# EAGLE design base-6u-at91sam7s-eval-r1 (EAGLE 4.16)
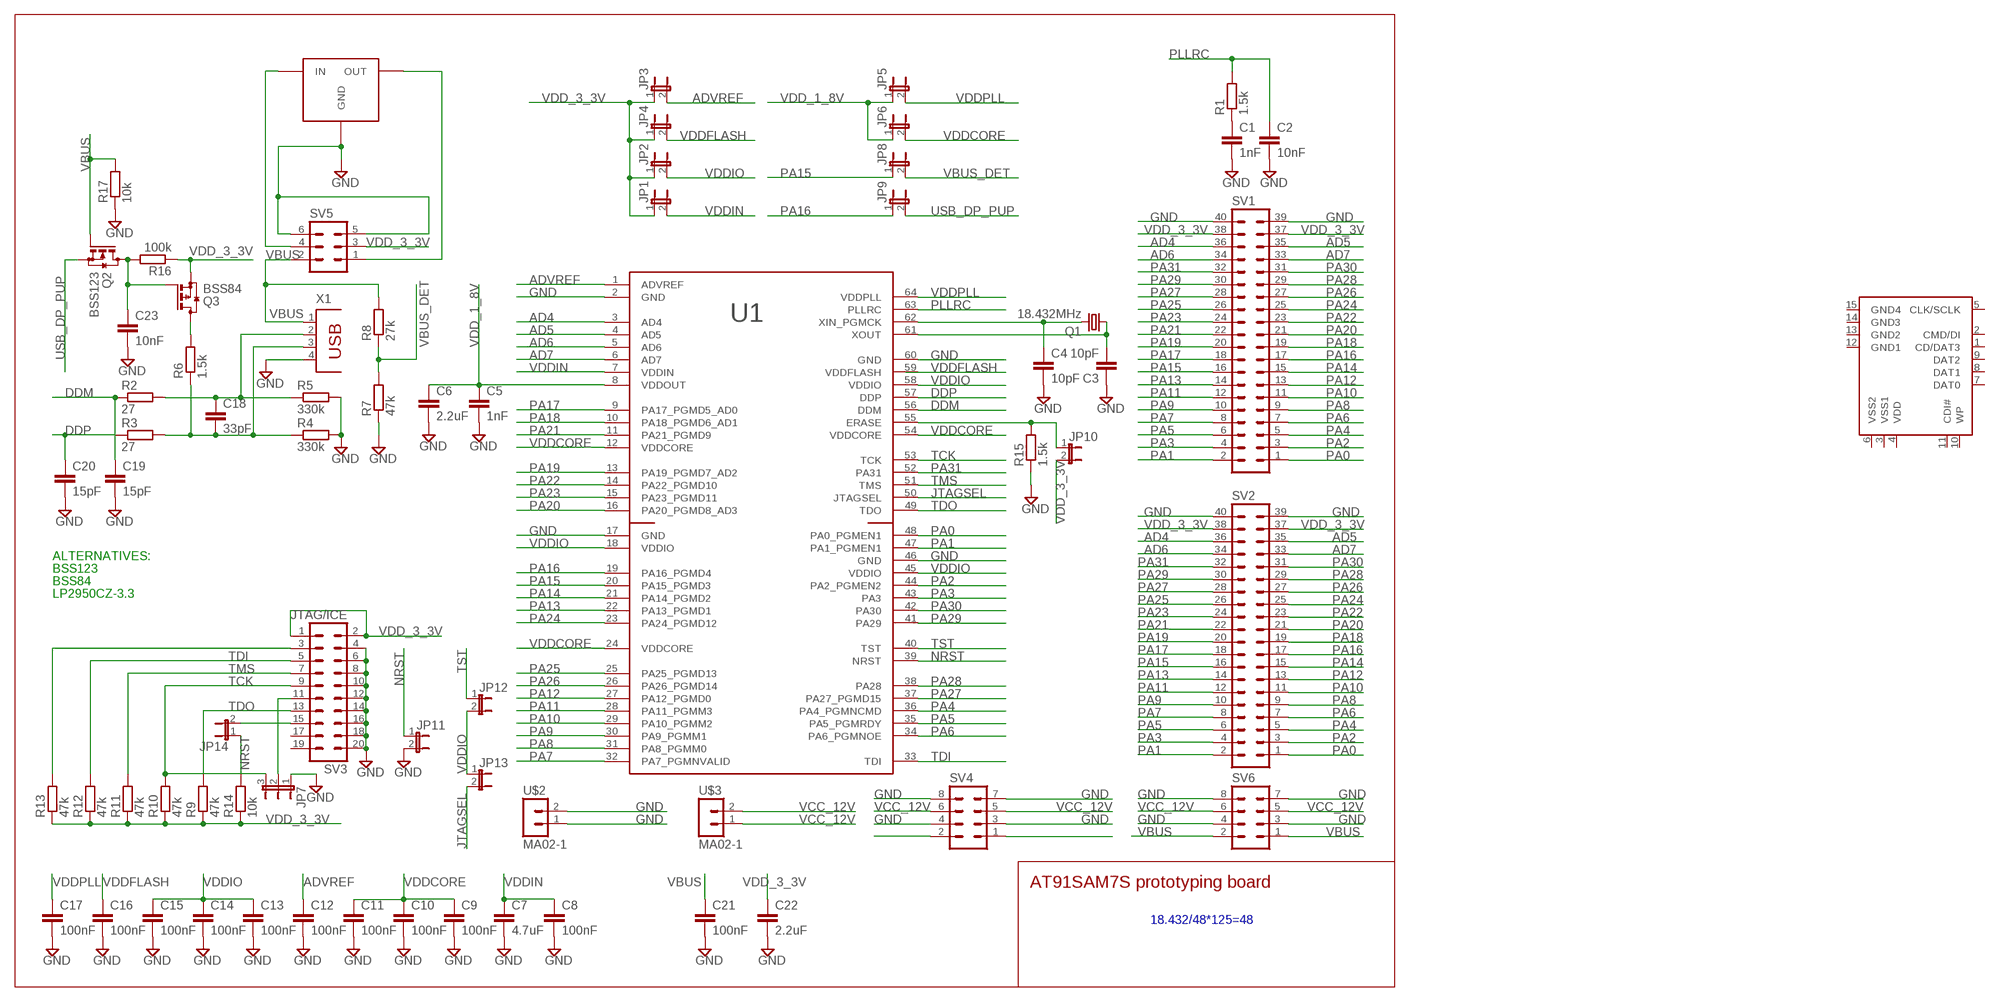
[diagram p0: schematic, sheet 1]

## Parts
C1  1nF  C-EUC0603  [C0603]
C2  10nF  C-EUC0603  [C0603]
C3  10pF  C-EUC0603  [C0603]
C4  10pF  C-EUC0603  [C0603]
C5  1nF  C-EUC0603  [C0603]
C6  2.2uF  C-EUC1206  [C1206]
C7  4.7uF  C-EUC1206  [C1206]
C8  100nF  C-EUC0603  [C0603]
C9  100nF  C-EUC0603  [C0603]
C10  100nF  C-EUC0603  [C0603]
C11  100nF  C-EUC0603  [C0603]
C12  100nF  C-EUC0603  [C0603]
C13  100nF  C-EUC0603  [C0603]
C14  100nF  C-EUC0603  [C0603]
C15  100nF  C-EUC0603  [C0603]
C16  100nF  C-EUC0603  [C0603]
C17  100nF  C-EUC0603  [C0603]
C18  33pF  C-EUC0603  [C0603]
C19  15pF  C-EUC0603  [C0603]
C20  15pF  C-EUC0603  [C0603]
C21  100nF  C-EUC0603  [C0603]
C22  2.2uF  C-EUC1206  [C1206]
C23  10nF  C-EUC0603  [C0603]
JP1  JP1E  [JP1]
JP2  JP1E  [JP1]
JP3  JP1E  [JP1]
JP4  JP1E  [JP1]
JP5  JP1E  [JP1]
JP6  JP1E  [JP1]
JP7  JP2E  [JP2]
JP8  JP1E  [JP1]
JP9  JP1E  [JP1]
JP10  JP1E  [JP1]
JP11  JP1E  [JP1]
JP12  JP1E  [JP1]
JP13  JP1E  [JP1]
JP14  JP1E  [JP1]
Q1  18.432MHz  CRYSTALHC49S  [HC49/S]
Q2  BSS123  [SOT23]
Q3  BSS84  [SOT23]
R1  1.5k  R-0603  [R0603]
R2  27  R-EU_R0603  [R0603]
R3  27  R-EU_R0603  [R0603]
R4  330k  R-EU_R0603  [R0603]
R5  330k  R-EU_R0603  [R0603]
R6  1.5k  R-EU_R0603  [R0603]
R7  47k  R-EU_R0603  [R0603]
R8  27k  R-EU_R0603  [R0603]
R9  47k  R-0603  [R0603]
R10  47k  R-0603  [R0603]
R11  47k  R-0603  [R0603]
R12  47k  R-0603  [R0603]
R13  47k  R-0603  [R0603]
R14  10k  R-0603  [R0603]
R15  1.5k  R-0603  [R0603]
R16  100k  R-EU_R0603  [R0603]
R17  10k  R-EU_R0603  [R0603]
SV1  MA20-2  [MA20-2]
SV2  MA20-2  [MA20-2]
SV3  JTAG/ICE  MA10-2W  [MA10-2W]
SV4  MA04-2  [MA04-2]
SV5  MA03-2  [MA03-2]
SV6  MA04-2  [MA04-2]
U1  AT91SAM7S64_LQFP64  [LQFP64]
U$1  LF33CDT  [TO-252]
U$2  MA02-1  [MA02-1]
U$3  MA02-1  [MA02-1]
U$4  SDCARDVAR2  [SDCMF-10915W010]
X1  PN61729  [PN61729]

## Nets
AD4: SV1.36 SV2.36 U1.3(AD4)
AD5: SV1.35 SV2.35 U1.4(AD5)
AD6: SV1.34 SV2.34 U1.5(AD6)
AD7: SV1.33 SV2.33 U1.6(AD7)
ADVREF: C12.1 JP3.2 U1.1(ADVREF)
DDM: C19.1 R2.1 U1.56(DDM)
DDP: C20.1 R3.1 U1.57(DDP)
GND: C1.2 C2.2 C3.1 C4.2 C5.2 C6.2 C7.2 C8.2 C9.2 C10.2 C11.2 C12.2 C13.2 C14.2 C15.2 C16.2 C17.2 C19.2 C20.2 C21.2 C22.2 C23.2 JP7.1 JP11.2 R4.2 R5.2 R7.1 R15.1 R17.1 SV1.39 SV1.40 SV2.39 SV2.40 SV3.4 SV3.6 SV3.8 SV3.10 SV3.12 SV3.14 SV3.16 SV3.18 SV3.20 SV4.3 SV4.4 SV4.7 SV4.8 SV5.5 SV5.6 SV6.3 SV6.4 SV6.7 SV6.8 U1.2(GND) U1.17(GND) U1.46(GND) U1.60(GND) U$1.3(GND) U$2.1 U$2.2 X1.4
JTAGSEL: JP13.2 U1.50(JTAGSEL)
N$1: C4.1 Q1.2 U1.62(XIN_PGMCK)
N$2: C3.2 Q1.1 U1.61(XOUT)
N$3: C1.1 R1.1
N$4: C18.1 R2.2 R5.1 X1.2
N$5: C18.2 R3.2 R4.1 R6.1 X1.3
N$7: Q3.3(D) R6.2
N$9: JP14.2 SV3.15
N$11: SV5.4 U$1.1(IN)
N$12: SV5.1 U$1.2(OUT)
N$13: R13.2 SV3.3
N$15: JP10.1 R15.2 U1.55(ERASE)
N$16: JP7.2 SV3.11
N$17: C23.1 Q2.3(D) Q3.1(G) R16.2
NRST: JP11.1 JP14.1 R14.2 U1.39(NRST)
PA0: SV1.1 SV2.1 U1.48(PA0_PGMEN1)
PA1: SV1.2 SV2.2 U1.47(PA1_PGMEN1)
PA2: SV1.3 SV2.3 U1.44(PA2_PGMEN2)
PA3: SV1.4 SV2.4 U1.43(PA3)
PA4: SV1.5 SV2.5 U1.36(PA4_PGMNCMD)
PA5: SV1.6 SV2.6 U1.35(PA5_PGMRDY)
PA6: SV1.7 SV2.7 U1.34(PA6_PGMNOE)
PA7: SV1.8 SV2.8 U1.32(PA7_PGMNVALID)
PA8: SV1.9 SV2.9 U1.31(PA8_PGMM0)
PA9: SV1.10 SV2.10 U1.30(PA9_PGMM1)
PA10: SV1.11 SV2.11 U1.29(PA10_PGMM2)
PA11: SV1.12 SV2.12 U1.28(PA11_PGMM3)
PA12: SV1.13 SV2.13 U1.27(PA12_PGMD0)
PA13: SV1.14 SV2.14 U1.22(PA13_PGMD1)
PA14: SV1.15 SV2.15 U1.21(PA14_PGMD2)
PA15: JP8.1 SV1.16 SV2.16 U1.20(PA15_PGMD3)
PA16: JP9.1 SV1.17 SV2.17 U1.19(PA16_PGMD4)
PA17: SV1.18 SV2.18 U1.9(PA17_PGMD5_AD0)
PA18: SV1.19 SV2.19 U1.10(PA18_PGMD6_AD1)
PA19: SV1.20 SV2.20 U1.13(PA19_PGMD7_AD2)
PA20: SV1.21 SV2.21 U1.16(PA20_PGMD8_AD3)
PA21: SV1.22 SV2.22 U1.11(PA21_PGMD9)
PA22: SV1.23 SV2.23 U1.14(PA22_PGMD10)
PA23: SV1.24 SV2.24 U1.15(PA23_PGMD11)
PA24: SV1.25 SV2.25 U1.23(PA24_PGMD12)
PA25: SV1.26 SV2.26 U1.25(PA25_PGMD13)
PA26: SV1.27 SV2.27 U1.26(PA26_PGMD14)
PA27: SV1.28 SV2.28 U1.37(PA27_PGMD15)
PA28: SV1.29 SV2.29 U1.38(PA28)
PA29: SV1.30 SV2.30 U1.41(PA29)
PA30: SV1.31 SV2.31 U1.42(PA30)
PA31: SV1.32 SV2.32 U1.52(PA31)
PLLRC: C2.1 R1.2 U1.63(PLLRC)
TCK: JP7.3 R10.2 SV3.9 U1.53(TCK)
TDI: R12.2 SV3.5 U1.33(TDI)
TDO: R9.2 SV3.13 U1.49(TDO)
TMS: R11.2 SV3.7 U1.51(TMS)
TST: JP12.1 U1.40(TST)
USB_DP_PUP: JP9.2 Q2.2(S)
VBUS: C21.1 Q2.1(G) R8.2 R17.2 SV4.1 SV4.2 SV5.2 SV6.1 SV6.2 X1.1
VBUS_DET: JP8.2 R7.2 R8.1
VCC_12V: SV4.5 SV4.6 SV6.5 SV6.6 U$3.1 U$3.2
VDD_1_8V: C5.1 C6.1 JP5.1 JP6.1 U1.8(VDDOUT)
VDD_3_3V: C22.1 JP1.1 JP2.1 JP3.1 JP4.1 JP10.2 Q3.2(S) R9.1 R10.1 R11.1 R12.1 R13.1 R14.1 R16.1 SV1.37 SV1.38 SV2.37 SV2.38 SV3.1 SV3.2 SV5.3
VDDCORE: C9.1 C10.1 C11.1 JP6.2 U1.12(VDDCORE) U1.24(VDDCORE) U1.54(VDDCORE)
VDDFLASH: C16.1 JP4.2 U1.59(VDDFLASH)
VDDIN: C7.1 C8.1 JP1.2 U1.7(VDDIN)
VDDIO: C13.1 C14.1 C15.1 JP2.2 JP12.2 JP13.1 U1.18(VDDIO) U1.45(VDDIO) U1.58(VDDIO)
VDDPLL: C17.1 JP5.2 U1.64(VDDPLL)
Unconnected: SV3.17 SV3.19 U$4.1(CD/DAT3) U$4.2(CMD/DI) U$4.5(CLK/SCLK) U$4.7(DAT0) U$4.8(DAT1) U$4.9(DAT2) U$4.10(WP) U$4.11(CDI#)

## Notes on the sheet
- ALTERNATIVES:
- BSS123
- BSS84
- LP2950CZ-3.3
- AT91SAM7S prototyping board
- 18.432/48*125=48

## Power pins joined to a net without a drawn wire
GND1: U$4.12(GND1)
GND2: U$4.13(GND2)
GND3: U$4.14(GND3)
GND4: U$4.15(GND4)
VDD: U$4.4(VDD)
VSS1: U$4.3(VSS1)
VSS2: U$4.6(VSS2)

## Library data of the parts
C1-C23 = rcl:C-EU: CAPACITOR, European symbol
JP1-JP6 JP8-JP14 = jumper:JP1E: JUMPER
JP7 = jumper:JP2E: JUMPER
Q1 = crystal:CRYSTAL: CRYSTAL
Q2 = transistor-small-signal:BSS123: N-CHANNEL MOS FET
Q3 = transistor-small-signal:BSS84: P-CHANNEL MOS FET
R1 R9-R15 = quantum-sensor:R: Resistor
R2-R8 R16 R17 = rcl:R-EU_: RESISTOR, European symbol
SV1 SV2 = con-lstb:MA20-2: PIN HEADER
SV3 = con-lstb:MA10-2W: PIN HEADER
SV4 SV6 = con-lstb:MA04-2: PIN HEADER
SV5 = con-lstb:MA03-2: PIN HEADER
U1 = Atmel_Prototype_Header:AT91SAM7S64: Atmel AT91 ARM Thumb-based Microcontroller. LQFP64 package.
U$1 = my-to252:LF33CDT
U$2 U$3 = cls:MA02-1
U$4 = kingfont_sdcmf10915w010_covek:SDCARD: SD card connector KINGFONT SDCMF-10915W010
X1 = con-berg:PN61729: BERG USB connector

## Board
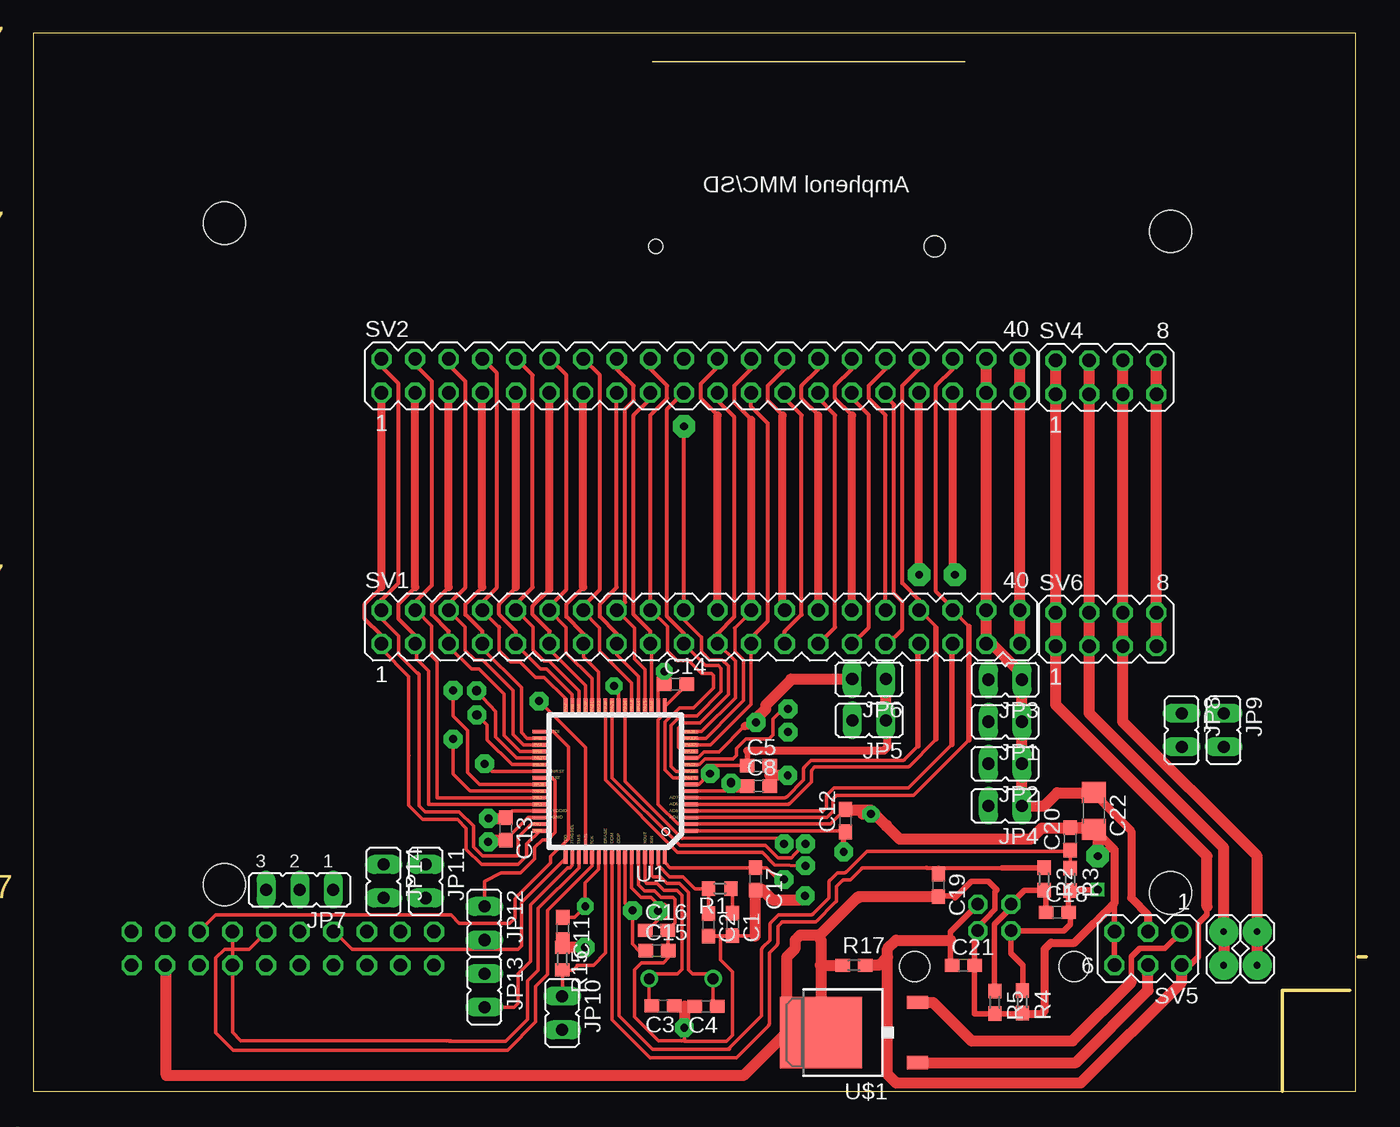
[diagram p1: board, top side]
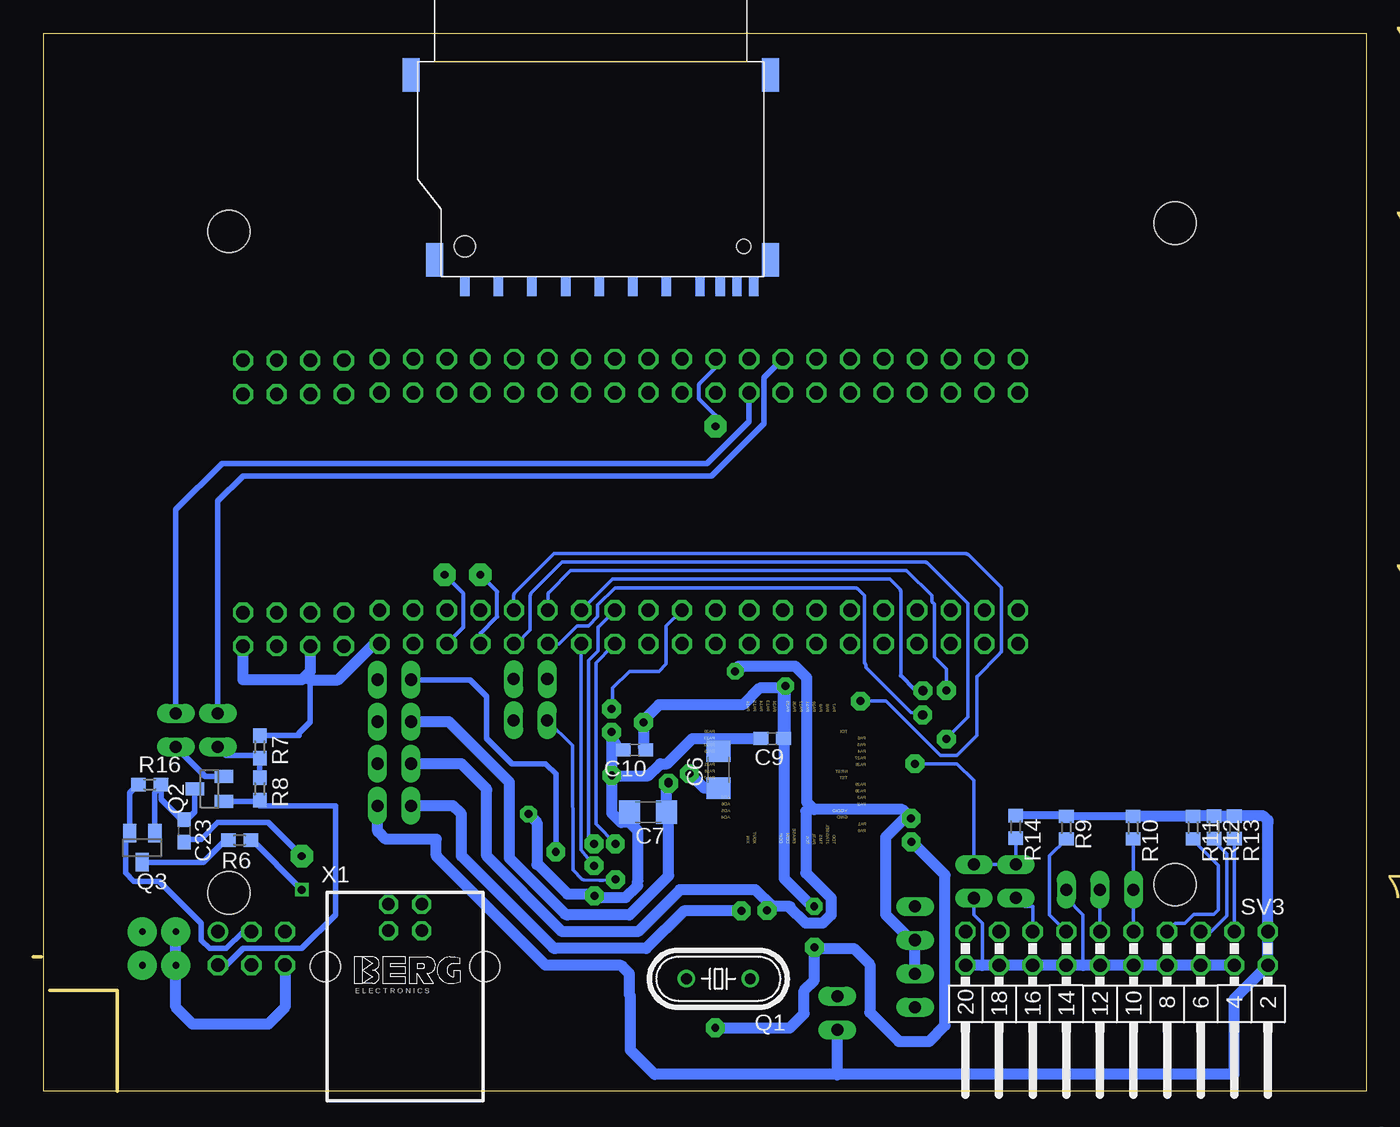
[diagram p2: board, bottom side, seen from below]

Size 100.8 x 80.01 mm. Coordinates in mm from the lower left corner, seen from the top.
Outline: 100.16,10.16 100.8,10.16
Outline: 99.53,7.62 94.45,7.62 94.45,0
Outline: 0,0.01 100,0.01 100,80.01 0,80.01 0,0.01
Copper layers (1*16): Top 0.035mm / dielectric 1.5mm / Bottom 0.035mm
Design rules "default": minimum track width 10mil, minimum drill 24mil, track to track 8mil, track to pad 8mil, pad to pad 8mil, via to via 8mil, smd to smd 8mil, copper to edge 40mil, drill to drill 8mil, minimum pad ring 10mil, minimum via ring 8mil, stop-mask expansion 4mil, vias tented up to drill 0mil, thermal gap 10mil
Holes 3.2 mm at 14.47,15.63 14.47,65.64 86,15 86,65.01

### Footprints (pad centres in the part's own frame; a part is rotated, then mirrored left to right if it is on the bottom)
C0603 = smd 1.1 x 1: 1 -0.85,0; 2 0.85,0
C1206 = smd 1.6 x 1.8: 1 -1.4,0; 2 1.4,0
JP1 = drill 0.914 long: 1 0,-1.27; 2 0,1.27
JP2 = drill 0.914 long: 1 -2.54,0; 2 0,0; 3 2.54,0
HC49/S = drill 0.813 round: 1 -2.413,0; 2 2.413,0
SOT23 = smd 1 x 1.4: 1 -0.95,-1.1; 2 0.95,-1.1; 3 0,1.1
R0603 = smd 1 x 1.1: 1 -0.85,0; 2 0.85,0
R0603' = smd 1.1 x 1: 1 -0.85,0; 2 0.85,0
MA20-2 = drill 1.016 octagon: 1 -24.13,-1.27; 2 -24.13,1.27; 3 -21.59,-1.27; 4 -21.59,1.27; 5 -19.05,-1.27; 6 -19.05,1.27; 7 -16.51,-1.27; 8 -16.51,1.27; 9 -13.97,-1.27; 10 -13.97,1.27; 11 -11.43,-1.27; 12 -11.43,1.27; 13 -8.89,-1.27; 14 -8.89,1.27; 15 -6.35,-1.27; 16 -6.35,1.27; 17 -3.81,-1.27; 18 -3.81,1.27; 19 -1.27,-1.27; 20 -1.27,1.27; 21 1.27,-1.27; 22 1.27,1.27; 23 3.81,-1.27; 24 3.81,1.27; 25 6.35,-1.27; 26 6.35,1.27; 27 8.89,-1.27; 28 8.89,1.27; 29 11.43,-1.27; 30 11.43,1.27; 31 13.97,-1.27; 32 13.97,1.27; 33 16.51,-1.27; 34 16.51,1.27; 35 19.05,-1.27; 36 19.05,1.27; 37 21.59,-1.27; 38 21.59,1.27; 39 24.13,-1.27; 40 24.13,1.27
MA10-2W = drill 1.016 octagon: 1 -11.43,-1.27; 2 -11.43,1.27; 3 -8.89,-1.27; 4 -8.89,1.27; 5 -6.35,-1.27; 6 -6.35,1.27; 7 -3.81,-1.27; 8 -3.81,1.27; 9 -1.27,-1.27; 10 -1.27,1.27; 11 1.27,-1.27; 12 1.27,1.27; 13 3.81,-1.27; 14 3.81,1.27; 15 6.35,-1.27; 16 6.35,1.27; 17 8.89,-1.27; 18 8.89,1.27; 19 11.43,-1.27; 20 11.43,1.27
MA04-2 = drill 1.016 octagon: 1 -3.81,-1.27; 2 -3.81,1.27; 3 -1.27,-1.27; 4 -1.27,1.27; 5 1.27,-1.27; 6 1.27,1.27; 7 3.81,-1.27; 8 3.81,1.27
MA03-2 = drill 1.016 round: 1 -2.54,-1.27 | drill 1.016 octagon: 2 -2.54,1.27; 3 0,-1.27; 4 0,1.27; 5 2.54,-1.27; 6 2.54,1.27
LQFP64 = smd 1.1 x 0.285: 1 -5.7,3.75; 2 -5.7,3.25; 3 -5.7,2.75; 4 -5.7,2.25; 5 -5.7,1.75; 6 -5.7,1.25; 7 -5.7,0.75; 8 -5.7,0.25; 9 -5.7,-0.25; 10 -5.7,-0.75; 11 -5.7,-1.25; 12 -5.7,-1.75; 13 -5.7,-2.25; 14 -5.7,-2.75; 15 -5.7,-3.25; 16 -5.7,-3.75; 33 5.7,-3.75; 34 5.7,-3.25; 35 5.7,-2.75; 36 5.7,-2.25; 37 5.7,-1.75; 38 5.7,-1.25; 39 5.7,-0.75; 40 5.7,-0.25; 41 5.7,0.25; 42 5.7,0.75; 43 5.7,1.25; 44 5.7,1.75; 45 5.7,2.25; 46 5.7,2.75; 47 5.7,3.25; 48 5.7,3.75 | smd 0.285 x 1.1: 17 -3.75,-5.7; 18 -3.25,-5.7; 19 -2.75,-5.7; 20 -2.25,-5.7; 21 -1.75,-5.7; 22 -1.25,-5.7; 23 -0.75,-5.7; 24 -0.25,-5.7; 25 0.25,-5.7; 26 0.75,-5.7; 27 1.25,-5.7; 28 1.75,-5.7; 29 2.25,-5.7; 30 2.75,-5.7; 31 3.25,-5.7; 32 3.75,-5.7; 49 3.75,5.7; 50 3.25,5.7; 51 2.75,5.7; 52 2.25,5.7; 53 1.75,5.7; 54 1.25,5.7; 55 0.75,5.7; 56 0.25,5.7; 57 -0.25,5.7; 58 -0.75,5.7; 59 -1.25,5.7; 60 -1.75,5.7; 61 -2.25,5.7; 62 -2.75,5.7; 63 -3.25,5.7; 64 -3.75,5.7
TO-252 = smd 1 x 1.6: 1 -2.28,-6.07; 2 2.28,-6.07 | smd 5.4 x 6.2: 3 0,1.23
MA02-1 = drill 0.5 pad 2.184 round: 1 -1.27,0; 2 1.27,0
SDCMF-10915W010 = smd 0.711 x 1.422: 1 7.366,13.462; 2 4.826,13.462; 3 2.286,13.462; 4 -0.254,13.462; 5 -2.794,13.462; 6 -5.334,13.462; 7 -7.874,13.462; 8 -9.398,13.462; 9 9.906,13.462; 10 -11.938,13.462; 11 -10.668,13.462 | smd 1.27 x 2.54: 12 12.192,11.43; 13 13.97,-2.54; 14 -13.208,-2.54; 15 -13.208,11.43 | hole 1.6: 9.906,10.414 | hole 1.1: -11.176,10.414
PN61729 = drill 0.95 octagon: 1 1.25,4.71; 2 -1.25,4.71; 3 -1.25,2.71; 4 1.25,2.71 | hole 2.3: -6.02,0; 6.02,0

### Placement (x,y rotation side)
C1  52.88,12.61 270 top
C2  51.05,12.57 270 top
C3  47.63,6.46 180 top
C4  50.87,6.42 180 top
C5  54.85,24.62 0 top
C6  48.99,24.32 90 bottom
C7  54.31,21.1 180 bottom
C8  54.85,23.08 0 top
C9  44.92,26.67 180 bottom
C10  55.31,25.81 180 bottom
C11  40.05,12.3 270 top
C12  61.41,20.46 90 top
C13  35.73,19.85 270 top
C14  48.57,30.77 0 top
C15  47.16,10.63 0 top
C16  47.14,12.16 0 top
C17  54.62,16.05 270 top
C18  77.42,13.54 0 top
C19  68.44,15.58 270 top
C20  78.41,19.1 90 top
C21  70.32,9.53 0 top
C22  80.2,21.2 270 top
C23  89.37,19.69 270 bottom
JP1  73.5,27.94 90 top
JP2  73.5,24.77 90 top
JP3  73.5,31.12 90 top
JP4  73.5,21.59 90 top
JP5  63.2,28.05 90 top
JP6  63.19,31.16 90 top
JP7  20.15,15.24 180 top
JP8  86.83,27.31 180 top
JP9  90,27.31 180 top
JP10  40,5.91 180 top
JP11  29.68,15.88 180 top
JP12  34.12,12.7 180 top
JP13  34.12,7.62 180 top
JP14  26.5,15.88 180 top
Q1  48.99,8.51 180 bottom
Q2  87.47,22.86 90 bottom
Q3  92.55,18.42 180 bottom
R1  51.91,15.32 180 top
R2  27  [R0603']  76.43,16.05 270 top
R3  27  [R0603']  78.4,16.03 270 top
R4  330k  [R0603']  74.78,6.76 270 top
R5  330k  [R0603']  72.7,6.71 270 top
R6  1.5k  [R0603']  85.19,18.99 180 bottom
R7  47k  [R0603']  83.66,26.04 270 bottom
R8  27k  [R0603']  83.66,22.86 270 bottom
R9  22.68,19.93 270 bottom
R10  17.63,19.93 270 bottom
R11  13.09,19.93 270 bottom
R12  11.53,19.96 270 bottom
R13  9.99,19.95 270 bottom
R14  26.52,19.99 270 bottom
R15  40.02,10.03 270 top
R16  100k  [R0603']  91.97,23.19 0 bottom
R17  10k  [R0603']  62.06,9.53 0 top
SV1  50.47,35.09 0 top
SV2  50.47,54.09 0 top
SV3  18.88,10.79 180 bottom
SV4  81.11,53.98 0 top
SV5  84.29,10.79 180 top
SV6  81.11,34.92 0 top
U1  44.01,23.45 180 top
U$1  60.8,4.45 90 top
U$2  90,10.79 90 top
U$3  92.55,10.79 90 top
U$4  58.25,74.3 180 bottom
X1  72.67,9.42 0 bottom

### Tracks (layer width: path | path; a pad name or v marks a point on that pad's centre or on a via)
AD4
  Top 0.254: U1.3 60.02,20.7 60.48,21.16 60.48,22.1 60.75,22.37 66.55,22.37 70.76,26.58 | SV1.36 69.45,36.45 | SV1.36 | 70.76,35.13 SV1.36
  Top 0.305: SV2.36 69.52,54.61 68.26,53.34 68.26,37.78 69.53,36.51 69.52,36.51 SV1.36
  Top 0.406: 70.76,26.58 70.76,35.13
AD5  (via drill 0.6 pad 1.68)
  Top 0.254: U1.4 59.72,21.2 59.98,21.46 59.98,22.36 60.55,22.93 66.17,22.93 69.48,26.24 | 69.48,33.78 SV1.35
  Top 0.305: SV2.35 | v69.69,39.05 69.53,38.89
  Top 0.406: 69.48,26.24 69.48,33.78
  Top 0.61: 69.53,38.89 SV2.35
  Bottom 0.305: SV1.35 68.26,35.09 68.26,37.62 v69.69,39.05
AD6
  Top 0.254: SV1.34 SV1.34 arc45 67.01,36.38 67.02,36.38 68.2,35.21 arc-45 68.27,35.03 | U1.5 57.03,21.7 arc45 57.21,21.77 58.85,23.41 58.85,24.16 arc-45 58.92,24.34 59.09,24.51 66.05,24.51 arc45 66.23,24.58 68.18,26.53 arc-45 68.19,26.54 68.27,26.62
  Top 0.305: SV2.34 66.98,54.61 65.72,53.34 65.72,38.42 66.99,37.15 SV1.34 | 66.99,36.51 66.98,36.51 SV1.34 | SV1.34
  Top 0.406: 68.27,26.62 68.27,35.03
AD7  (via drill 0.6 pad 1.68)
  Top 0.254: SV1.33 67,33.82 66.91,33.73 | U1.6 56.8,22.2 arc45 56.98,22.27 58.24,23.53 58.24,24.33 arc-45 58.31,24.51 58.81,25.01 65.7,25.01 arc45 65.88,25.08 66.91,26.11 66.91,26.1
  Top 0.305: 66.99,52.86 SV2.33
  Top 0.406: 66.91,26.11 66.91,33.73
  Top 0.61: v66.99,39.05 SV2.33
  Bottom 0.305: SV1.33 66.98,34.61 65.72,35.88 65.72,37.78 v66.99,39.05
ADVREF  (via drill 0.6 pad 1.42)
  Top 0.254: C12.1 61.41,19.67 61.43,19.69 61.42,19.7 U1.1
  Top 0.406: 61.41,19.67 61.28,19.67 v61.28,18.11
  Bottom 0.406: v61.28,18.11 61.28,23.98 62.06,24.77 64.61,24.77 66.51,26.67 66.51,29.85 67.78,31.12 JP3.2
DDM
  Top 0.254: U1.56 43.76,5.4 46.63,2.54 46.82,2.54 53.17,2.54 55.59,4.95 arc45 55.66,5.13 55.66,10.48 56.23,11.05 arc45 56.3,11.23 56.3,12.48 56.57,12.75 arc-45 56.74,12.82 59.19,12.82 60.68,14.31 arc45 60.75,14.49 60.75,15.5 61.16,15.91 arc-45 61.34,15.98 61.78,15.98 62.62,16.82 arc-45 62.8,16.9 67.55,16.9 | 73.24,16.9 73.24,16.91 | C19.1 arc-45 68.43,16.45 68.43,16.9
  Top 0.305: 67.53,16.9 67.55,16.9 68.43,16.9 73.24,16.9
  Top 0.406: R2.1 76.35,16.9 76.34,16.89 76.33,16.9 73.24,16.9
DDP
  Top 0.254: 44.28,17.71 44.28,5.72 46.82,3.17 52.64,3.17 arc-45 52.71,3.35 55.08,5.71 55.08,10.69 arc-45 55.15,10.87 55.71,11.43 55.71,12.6 arc-45 55.79,12.77 56.35,13.33 58.78,13.33 arc45 58.96,13.41 60.16,14.61 60.16,15.77 arc-45 60.23,15.95 60.8,16.51 61.3,16.51 arc45 61.48,16.58 63.03,18.14 67.57,18.14 arc45 67.62,18.16 | 67.62,18.16 67.61,18.15 | 67.62,18.16 78.36,18.16 78.45,18.25 C20.1 78.41,16.89 78.42,16.88 R3.1
  Top 0.305: U1.57 44.28,17.71
GND  (via drill 0.6 pad 1.27, 0.6 pad 1.42, 0.6 pad 1.68)
  Top 0.254: 49.24,3.8 49.23,3.79 49.23,3.82 | 51.28,11.72 51.25,11.75 | 51.94,11.72 51.96,11.71 51.96,9.95 52.88,9.03 52.88,4.24 52.44,3.79 49.27,3.79 | 49.23,3.82 49.21,3.83 | 49.27,3.79 49.25,3.79 49.24,3.8 | 49.24,3.8 49.23,3.82 | C2.2 51.05,11.71 51.06,11.71 51.11,11.75 C1.2 | C1.2 52.91,11.75 52.92,11.74 52.9,11.72 51.94,11.72 | 51.94,11.72 51.28,11.72 | 51.94,11.72 51.9,11.72 51.88,11.74 51.86,11.72 51.28,11.72 | C17.2 54.58,15.17 54.58,11.73 54.57,11.74 C1.2 | C1.2 | C1.2 | 48.75,20.21 47.25,21.71 47.25,28.07 47.76,28.58 U1.17 47.83,29.15 49.45,30.77 C14.2 | U1.2 49.66,20.2 49.64,20.18 49.61,20.21 48.75,20.21 | C12.2 61.4,21.34 60.27,20.21 48.75,20.21 | C13.2 37.43,20.7 U1.46 | C5.2 55.7,23.89 C8.2 | 49.24,3.8 49.24,5.63 C4.2 49.26,6.42 48.5,6.42 48.49,6.42 48.48,6.42 C3.1 | 49.27,3.79 49.27,3.82 47.29,3.82 45.46,5.64 45.46,9.17 46,9.71 47.65,9.71 48.09,10.16 48,10.25 C15.2 48,10.66 47.99,10.67 47.99,10.68 C16.2 47.99,12.2 47.99,12.21 48.53,12.74 48.53,14.52 48.38,14.66 47.47,14.66 46.97,15.16 46.21,15.16 45.76,15.62 U1.60 | 80.48,19.89 80.48,19.69 80.44,19.73 arc45 80.26,19.8 C22.2 | C11.2 40.02,11.42 R15.1
  Top 0.406: SV3.18 | SV3.16 | SV3.14 | SV3.10 | SV3.12 | SV3.6 | SV3.8 | SV3.20 | C19.2 68.45,14.79 69.5,14.79 69.69,14.61 70.95,15.88 72.22,15.88 72.86,15.24 72.86,15.23 72.7,15.07 72.72,13.74 71.42,12.39 X1.4 71.17,11.88 C21.2 71.17,5.87 R5.2 | R5.2 | R4.2 74.78,5.87 R5.2 | SV5.6 SV5.5 81.75,13.97 81.62,14.1 | 81.77,18.26 80.95,18.26 v80.48,17.78
  Top 0.61: C17.2 54.65,15.24 | R4.2 74.65,5.92 74.64,5.9 74.68,5.87 76.28,5.87 76.49,6.08 76.49,10.75 76.96,11.22 78.73,11.22 80.2,12.7 80.22,12.7 81.62,14.1 81.77,14.25 81.77,18.26 80.22,19.8 C22.2
  Top 0.813: v57.05,23.89 55.7,23.89 | 80.48,19.89 C20.2 | 80.48,19.89 76.23,19.89 75.4,19.05 65.53,19.05 64.5,20.08 | 64.5,20.08 63.33,21.25 62.7,21.25 | C12.2 61.37,21.37 | C12.2 | 62.7,21.25 61.49,21.25 C12.2 | 54.58,11.73 54.58,14.74 55.08,15.24 55.14,15.24 55.94,14.45 57.93,14.45 v58.37,14.79 | 62.7,21.25 62.7,20.96 v63.34,20.96 | v41.73,10.88 R15.1 | 49.26,6.42 49.23,6.38 v49.23,4.79 | C13.2 34.48,19 v34.41,18.87 | 59.49,11.82 58.12,11.82 arc45 57.94,11.75 57.62,11.43 57.62,10.9 arc-45 57.55,10.72 56.98,10.16 56.98,4.55 arc-45 56.91,4.37 53.81,1.27 arc-45 53.63,1.2 10.07,1.2 10.07,9.45 SV3.4 | 64.5,20.08 64.53,20.12 arc-45 64.5,20.05 | 68.41,14.61 68.41,14.67 arc-45 C19.2 | 59.49,11.82 62.2,14.53 | 62.2,14.53 arc-45 62.38,14.61 | C19.2 | C19.2 | 62.2,14.53 62.4,14.73 C19.2 | 80.48,19.89 80.48,18.42 | 59.49,11.82 59.49,11.46 59.56,11.39 59.56,9.53 | 59.56,9.53 U$1.3 | 59.56,9.53 59.52,9.53 | 59.56,9.53 R17.1 | U$2.1 U$2.2 90,18.42 79.84,28.58 SV6.3 SV6.4 SV4.3 SV4.4 | SV6.7 SV6.8 SV4.7 84.92,52.73 84.94,52.74 84.92,52.76 SV4.8 | 74.61,36.2 74.6,36.2 SV1.40 SV1.39 74.6,36.19 74.61,36.2 | SV2.39 | SV2.39 74.6,55.31 74.56,55.35 74.57,55.36 SV2.40 | 74.61,36.2 SV2.39
  Bottom 0.254: 34.76,19.05 34.57,18.87 v34.41,18.87 | SV3.6 | SV3.8 | SV3.10 | SV3.12 | SV3.16 | SV3.18 | SV3.20 | JP7.1 22.7,14.61 21.42,13.33 21.42,9.52 | JP11.2 29.68,13.33 29.04,12.7 29.04,9.52 | v57.06,27.16 57.06,27.06 56.8,26.8 C10.2
  Bottom 0.406: v41.74,10.88 41.78,10.83 | v41.73,10.88 v41.74,10.88 | v41.74,10.88 41.57,11.04 | R7.1 80.69,26.89 80.69,27.09 79.84,27.94 79.84,31.12 SV6.3 | v80.48,17.78 83.02,20.32 86.83,20.32 88.1,19.05 89.17,19.05 89.37,18.86 C23.2 89.37,19.05 | C7.2 55.71,20.96 55.71,20.32
  Bottom 0.813: v57.06,27.16 v57.05,27.15 v57.05,23.89 | 55.08,15.9 55.08,15.88 | 55.08,15.9 55.08,19.69 55.71,20.32 56.35,20.32 57.05,21.02 57.05,21.66 57.04,21.67 v57.04,23.89 v57.05,23.89 | 55.08,15.9 55.1,15.9 55.1,15.54 56,14.64 58.16,14.64 58.39,14.88 58.38,14.88 v58.37,14.79 58.37,14.91 58.36,14.92 60.4,14.92 62.62,17.15 62.7,17.15 62.7,20.32 v63.34,20.96 | v49.23,4.79 43.59,4.79 42.52,5.87 42.52,7.62 41.73,8.4 v41.73,10.88 41.73,10.81 41.74,10.79 38.75,10.79 37.55,9.6 37.55,5.96 35.36,3.78 33.05,3.78 31.85,4.97 31.85,16.35 34.37,18.87 v34.41,18.87 | 79.81,33.79 79.84,33.76 SV6.3 79.84,31.75 80.48,31.12 84.92,31.12 SV6.7 | U$2.2 90,6.35 88.73,5.08 83.02,5.08 81.75,6.35 SV5.6 | SV3.12 SV3.10 SV3.8 SV3.6 SV3.4 | SV3.12 21.42,9.52 SV3.14 SV3.16 SV3.18 29.04,9.52 SV3.20 | SV1.39 75.01,33.82 77.73,31.11 79.87,31.11 79.89,31.12 79.84,31.12 | 49.05,26.67 50.95,26.67 52.86,24.77 53.38,24.77 54.3,23.85 57.02,23.85 v57.06,23.89 | 49.05,26.67 C9.2 | v57.06,23.89 57.07,23.9 | v57.05,23.89 v57.06,23.89 | 49.05,26.67 49.05,26.35 48.99,26.3 C6.2
JTAGSEL
  Top 0.254: U1.50 40.76,17.07 40.59,16.9 40.39,16.9 37.6,14.11 37.6,9.82 36.66,8.89 36.66,6.67 36.35,6.35 JP13.2
N$1
  Top 0.254: Q1.2 51.41,8.58 | Q1.2 | U1.62 46.76,16.32 46.86,16.21 47.42,16.21 47.91,15.72 48.88,15.72 49.55,15.05 49.55,9.19 49.84,8.89 51.1,8.89 51.43,8.56 51.4,8.54 Q1.2 | Q1.2 51.4,8.55 | 51.83,6.42 51.91,6.35 | C4.1 51.83,6.42 | Q1.2 51.41,6.84 51.83,6.42
N$2
  Top 0.254: U1.61 46.25,17.79 | U1.61 | U1.61 46.25,15.86 46.39,15.71 47.18,15.71 47.69,15.21 48.67,15.21 49.06,14.81 49.06,9.22 48.73,8.89 46.98,8.89 Q1.1 | Q1.1 | 46.78,6.39 46.82,6.35 | C3.2 46.78,6.39 | Q1.1 46.58,6.59 46.78,6.39
N$3
  Top 0.254: 52.73,15.32 | 52.73,15.32 R1.1 | C1.1 52.88,15.17 52.73,15.32
N$4
  Top 0.305: R2.2 76.41,15.19 76.57,15.03
  Top 0.406: R5.1 72.67,7.58 72.67,12.62 73.92,13.88 X1.2 73.92,14.17 74.94,15.19 76.3,15.19 76.35,15.24 76.4,15.2 R2.2 | R2.2 76.41,15.22 | C18.1 76.57,15.06 R2.2
N$5  (via drill 0.6)
  Top 0.406: R4.1 74.81,7.64 74.81,9.54 73.92,10.42 X1.3 77.93,12.13 78.43,12.63 78.43,13.39 78.29,13.54 C18.2 | 78.29,13.48 78.27,13.5 C18.2 | C18.2 78.27,15.04 R3.2 78.51,15.17 78.58,15.24 v80.48,15.24
  Bottom 0.406: R6.1 84.29,19.05 v80.48,15.24
N$7
  Bottom 0.406: R6.2 86.13,18.99 86.19,19.05 87.93,17.32 Q3.3
N$9
  Bottom 0.254: SV3.15 25.23,13.96 25.23,13.97 25.87,13.97 JP14.2
N$11
  Top 0.813: U$1.1 78.83,2.17 84.29,7.62 SV5.4
N$12
  Top 0.406: 83.02,8.26 83.02,10.16 83.66,10.79 85.56,10.79 SV5.1
  Top 0.813: U$1.2 68.04,6.72 70.95,3.81 78.58,3.81 83.02,8.26
N$13
  Bottom 0.254: SV3.3 9.99,12.07 R13.2
N$15
  Top 0.254: R15.2 39.99,9.17 39.97,9.15 40.23,8.89 | JP10.1 | JP10.1 | R15.2 40.02,7.2 JP10.1 | 40.01,9.1 40.02,9.1 R15.2 | 40,9.14 40.02,9.16 R15.2 | 40,9.14 40.82,9.14 41.12,9.45 41.12,9.52 41.11,9.53 42.35,9.53 43.26,10.46 U1.55 | 40,9.14 39.98,9.12
N$16
  Bottom 0.254: SV3.11 JP7.2
N$17
  Bottom 0.406: Q3.1 91.59,22.54 91.12,23.02 R16.2 91.12,22.07 89.37,20.32 | 89.37,20.32 C23.1 | Q2.3 88.56,21.12 89.37,20.32
NRST  (via drill 0.6 pad 1.42)
  Top 0.254: U1.39 34.7,24.2 v34.12,24.77
  Bottom 0.254: R14.2 26.52,19.06 26.5,19.05 JP14.1 JP11.1 29.68,23.5 30.95,24.77 v34.12,24.77
PA0
  Top 0.254: SV1.1 26.34,33.43 28.4,31.38 28.4,25.4 | 28.4,25.4 28.4,25.3 | U1.48 37.3,18.69 37.3,17.78 36.66,17.15 33.9,17.15 32.75,18.3 32.75,19.89 32.08,20.56 29.44,20.56 28.4,21.6 28.4,25.39 28.41,25.4 28.4,25.4
  Top 0.305: 26.34,38.1 25.08,36.83 25.08,35.72 26.35,34.45 26.35,33.97 26.34,33.97 SV1.1
  Top 0.61: 26.34,38.1 SV2.1
PA1
  Top 0.254: 29.07,31.6 27.64,33.03 arc45 27.66,33.04 27.68,33.06 arc-45 27.64,33.16 27.64,34.42 26.41,35.65 arc-45 26.34,35.83 SV1.2 | 29.07,31.6 29.09,31.59 | U1.47 37.66,20.19 36.67,19.2 36.67,19.15 36.66,19.14 36.66,19.06 36.66,19.05 36.66,17.78 33.98,17.78 33.29,18.48 33.29,20.06 32.22,21.12 29.63,21.12 29.18,21.58 29.18,31.57 29.11,31.64 29.07,31.6
  Top 0.305: SV2.2 26.34,54.77 27.62,53.5 27.62,38.42 26.35,37.15 SV1.2
PA2
  Top 0.254: 28.81,33.82 28.78,33.85 | 28.81,33.82 SV1.3 | 28.81,33.82 28.98,33.66 28.98,32.68 29.89,31.78 29.89,21.7 U1.44
  Top 0.305: 28.88,38.1 27.62,36.83 27.62,35.72 28.89,34.45 28.89,33.97 28.88,33.97 SV1.3
  Top 0.61: 28.88,38.1 SV2.3
PA3
  Top 0.254: SV1.4 28.93,36.36 28.95,36.38 30.14,35.2 30.14,32.91 30.56,32.48 30.56,22.2 U1.43
  Top 0.305: SV2.4 28.88,54.93 30.16,53.66 30.16,38.26 28.89,36.99 SV1.4
PA4
  Top 0.254: U1.36 36.82,25.7 35.62,26.9 35.62,30.04 33.73,31.93 33.14,31.93 31.42,33.64 SV1.5
  Top 0.305: 31.42,38.1 30.16,36.83 30.16,36.04 31.43,34.77 SV1.5
  Top 0.61: 31.42,38.1 SV2.5
PA5
  Top 0.254: U1.35 37.09,26.2 36.3,26.99 36.3,30.3 33.99,32.6 33.41,32.6 32.67,33.34 32.67,35.1 SV1.6
  Top 0.305: SV2.6 31.42,54.93 32.7,53.66 32.7,38.1 31.42,36.82 SV1.6
PA6
  Top 0.254: U1.34 37.36,26.7 36.94,27.12 36.94,30.52 33.96,33.49 SV1.7
  Top 0.305: 33.96,38.1 32.7,36.83 32.7,36.04 33.97,34.77 SV1.7
  Top 0.61: 33.96,38.1 SV2.7
PA7
  Top 0.254: U1.32 40.26,29.69 38.64,31.31 37.97,31.31 36.81,32.46 36.08,32.46 35.23,33.31 35.23,35.14 35.2,35.11 | SV1.8 33.93,36.38 | SV1.8 | 35.2,35.11 35.25,35.06 | 35.2,35.11 SV1.8
  Top 0.305: 33.93,36.38 33.93,36.95 35.08,38.1 35.08,54.29 33.97,55.4 33.96,55.4 SV2.8
PA8
  Top 0.254: 36.74,33.41 36.38,33.77 36.43,33.82 SV1.9 36.48,33.81 38.35,31.95 38.81,31.95 40.76,30 U1.31
  Top 0.305: 36.5,38.1 35.24,36.83 35.24,36.04 36.51,34.77 SV1.9
  Top 0.61: 36.5,38.1 SV2.9
PA9
  Top 0.254: U1.30 41.26,30.27 39.01,32.52 38.63,32.52 37.79,33.35 37.79,35.11 36.5,36.41 SV1.10
  Top 0.305: SV2.10 36.55,55.36 37.78,54.13 37.78,38.1 36.5,36.82 SV1.10
PA10
  Top 0.254: SV1.11 39.04,33.41 41.76,30.7 U1.29
  Top 0.305: 39.04,37.94 37.78,36.67 37.78,36.04 39.05,34.77 SV1.11
  Top 0.61: 39.04,37.94 SV2.11
PA11
  Top 0.254: U1.28 42.26,31.2 40.31,33.14 40.31,35.07 39.04,36.34 SV1.12
  Top 0.305: SV2.12 39.09,55.36 40.32,54.13 40.32,37.94 39.04,36.66 SV1.12
PA12
  Top 0.254: U1.27 42.76,31.7 41.61,32.84 41.61,33.84 SV1.13
  Top 0.305: 41.58,38.1 40.32,36.83 40.32,35.88 41.59,34.61 SV1.13
  Top 0.61: 41.58,38.1 SV2.13
PA13
  Top 0.254: U1.22 45.26,30.86 42.84,33.27 42.84,35.04 41.54,36.34 41.56,36.36 SV1.14
  Top 0.305: SV2.14 41.63,55.36 42.86,54.13 42.86,37.94 41.58,36.66 SV1.14
PA14
  Top 0.254: U1.21 45.76,31.37 44.11,33.02 44.11,33.84 SV1.15
  Top 0.305: SV2.15 44.12,38.1 42.86,36.83 42.86,35.88 44.13,34.61 SV1.15
PA15
  Top 0.254: U1.20 46.26,31.9 45.48,32.67 45.48,35.02 SV1.16
  Top 0.305: 44.17,55.36 SV2.16 44.12,55.25 44.13,55.24 44.13,54.61 45.4,53.34 45.4,52.23 44.76,51.59 44.76,36.99 SV1.16
  Bottom 0.406: JP8.1 86.83,44.61 84.92,46.51 49.52,46.51 45.55,50.48 45.55,53.98 44.13,55.4 44.12,55.4 SV2.16
PA16
  Top 0.254: SV1.17 46.66,33.78 46.65,33.77 46.76,33.66 U1.19
  Top 0.305: SV1.17 46.66,34.77 45.4,36.04 45.4,51.12 46.67,52.39 46.66,52.39 SV2.17 46.66,52.86 46.67,52.86
  Bottom 0.406: JP9.1 90,43.97 86.51,47.47 49.84,47.47 46.67,50.64 46.67,52.55 46.82,52.7 46.71,52.82 SV2.17
PA17
  Top 0.254: SV1.18 46.73,36.36 47.96,35.13 47.96,33.29 48.69,32.56 49.55,32.56 50.53,31.59 51.3,31.59 51.45,31.44 51.45,30.49 49.94,28.98 48.86,28.98 47.79,27.91 47.77,27.91 47.77,24.31 48.37,23.71 49.69,23.71 U1.9 | U1.9 49.72,23.68 | U1.9
  Top 0.305: SV1.18 46.67,51.12 47.94,52.39 47.94,53.34 46.67,54.61 46.67,55.24 46.66,55.25 SV2.18
PA18
  Top 0.254: SV1.19 49.93,33.09 49.92,33.09 50.84,32.17 51.81,32.17 52.02,31.96 52.02,30.21 50.2,28.4 48.96,28.4 48.23,27.67 48.23,24.56 48.59,24.2 49.63,24.2 49.64,24.19 49.65,24.2 U1.10
  Top 0.305: SV1.19 49.2,34.61 47.94,35.88 47.94,51.59 49.2,52.86 | 49.2,52.86 49.21,52.86 | 49.2,52.86 SV2.19
PA19  (via drill 0.6 pad 1.68)
  Top 0.254: U1.13 49.1,25.7 48.79,26.01 48.79,27.46 49.16,27.84 50.41,27.84 52.56,29.99 52.56,32.15 52.1,32.6 51.15,32.6 50.52,33.23 50.52,34.34 50.5,34.34 49.2,35.63 49.2,36.34 | 49.2,36.34 SV1.20 | 49.2,36.34 49.19,36.34
  Top 0.305: SV2.20 49.2,55.25 | SV1.20 v49.21,50.27 v49.2,50.27
  Bottom 0.305: v49.2,50.27 49.2,51.09 50.45,52.34 50.45,53.45 49.17,54.73 49.17,55.36 49.18,55.38 SV2.20
PA20
  Top 0.254: U1.16 50.54,27.2 53.09,29.75 53.09,32.53 51.79,33.84 SV1.21 | SV1.21 51.72,33.84 | SV1.21
  Top 0.305: SV1.21 51.73,34.59 53.02,35.88 53.02,50.96 51.75,52.23 51.75,52.86 51.74,52.86 SV2.21
PA21  (via drill 0.6 pad 1.42)
  Top 0.254: U1.11 50.38,24.7 50.81,25.12 52.9,25.12 53.17,25.4 53.17,25.92 53.9,26.65 55.64,26.65 55.95,26.96 55.95,28.14 57.04,29.23 v57.07,28.91
  Top 0.305: 51.79,55.36 SV2.22 51.74,55.25 51.75,55.24 51.75,54.77 50.48,53.5 50.48,52.39 51.75,51.12 | SV1.22
  Top 0.61: SV1.22 51.75,51.12
  Bottom 0.254: SV1.22 51.76,36.36 52.95,35.17 52.95,32.29 53.49,31.75 55.71,31.75 56.98,30.48 56.98,29.21 57,29.23 v57.07,28.91
PA22
  Top 0.254: U1.14 51.23,26.2 54.28,29.25 54.28,33.77 54.24,33.81 54.25,33.82 SV1.23
  Top 0.305: SV1.23 54.28,34.28 55.56,35.56 55.56,50.48 54.29,51.75 54.29,52.86 54.28,52.86 SV2.23
PA23
  Top 0.254: U1.15 50.87,26.7 53.04,28.87 53.04,28.89 53.71,29.56 53.71,32.6 53.06,33.25 53.06,35.02 53.05,35.03 | 54.31,36.39 54.31,36.41 | 54.31,36.39 SV1.24 | 53.05,35.03 53.04,35.02 | 53.05,35.03 54.31,36.28 54.31,36.39 | 53.05,35.03 53.04,35.04
  Top 0.305: 54.31,50.78 53.02,52.07 53.02,53.34 54.29,54.61 54.29,55.4 54.28,55.4 SV2.24
  Top 0.61: 54.31,36.39 54.31,50.78
PA24  (via drill 0.6 pad 1.27, 0.6 pad 1.42)
  Top 0.254: U1.23 44.76,23.44 49.06,19.14 56.4,19.15 v56.78,18.7 | v56.88,33.82 SV1.25
  Top 0.305: SV1.25 56.82,34.76 58.1,36.04 58.1,51.12 56.82,52.39 SV2.25
  Bottom 0.254: v56.78,18.7 58.25,20.2 58.25,32.38 56.98,33.66 56.98,33.72 v56.88,33.82
PA25  (via drill 0.6 pad 1.42)
  Top 0.254: U1.25 43.76,23.71 48.89,18.58 55.37,18.58 56.32,17.64 57.32,17.64 57.57,17.91 v58.39,18.7 | SV1.26
  Top 0.305: SV2.26 56.82,54.61 55.56,53.34 55.56,52.23 56.67,51.12 | SV1.26 | SV1.26 | SV1.26 56.67,36.51
  Top 0.61: 56.67,36.51 56.67,51.12
  Bottom 0.254: SV1.26 58.07,35.11 58.09,35.11 58.09,33.29 58.81,32.58 58.81,19.27 v58.39,18.7
PA26  (via drill 0.6 pad 1.27, 0.6 pad 1.42)
  Top 0.254: U1.26 43.26,23.53 48.72,18.07 55.14,18.08 56.04,17.12 v58.39,17.06 | 59.37,33.85 v59.37,33.82 SV1.27
  Top 0.305: SV2.27 59.36,52.39 60.64,51.12 60.64,35.08 v59.37,33.82 | v59.37,33.82 v59.37,33.81 | v59.37,33.82
  Bottom 0.254: v59.37,33.82 59.37,18.25 v58.39,17.06
PA27  (via drill 0.7 pad 1.42)
  Top 0.254: U1.37 36.56,25.2 34.96,26.8 34.96,28.71 v33.53,30.29
  Top 0.305: SV2.28 59.36,54.61 58.1,53.34 58.1,52.39 59.37,51.12 | SV1.28
  Top 0.61: SV1.28 59.37,51.12
  Bottom 0.254: SV1.28 56.99,38.73 36.03,38.73 35.28,37.99 arc45 35.21,37.81 35.21,31.43
  Bottom 0.305: SV1.28 | v33.53,30.29 33.39,30.3 34.08,30.3 35.21,31.43
PA28  (via drill 0.7 pad 1.42)
  Top 0.254: U1.38 36.2,24.7 34.33,26.57 34.33,27.71 v33.55,28.46
  Top 0.305: SV2.29 61.9,52.39 63.18,51.12 63.18,35.08 SV1.29
  Bottom 0.254: v33.55,28.46 34.44,28.64 37.85,32.05 37.85,32.2 arc-45 37.92,32.37 37.94,32.38 37.94,37.46 38.45,37.98 arc-45 38.63,38.05 56.82,38.05 58.11,36.77 58.11,35.91 58.82,35.2 59.67,35.2 61.04,33.82 SV1.29
  Bottom 0.305: 61.91,33.85 SV1.29
PA29  (via drill 0.6 pad 1.42)
  Top 0.254: U1.41 33.75,23.2 32.85,24.1 32.85,27.29 31.75,28.39 31.75,30.33 | 31.75,30.33 31.74,30.32 v31.74,30.3 | 31.75,30.33 31.78,30.36
  Top 0.305: 62.06,36.35 62.05,36.36 SV1.30 | SV2.30 61.9,54.61 60.64,53.34 60.64,52.39 61.91,51.12
  Top 0.61: SV1.30 61.91,51.12
  Bottom 0.254: SV1.30 61.88,36.36 61.88,37.54 arc45 61.81,37.72 60.16,39.37 34.87,39.37 arc45 34.69,39.3 32.85,37.46 32.85,37.12 arc-45 32.78,36.95 32.66,36.82 32.66,32.82 31.75,31.92 v31.75,30.3 v31.74,30.3
PA30  (via drill 0.6 pad 1.42)
  Top 0.254: U1.42 33.04,22.7 31.75,23.99 v31.75,26.62 31.77,26.65
  Top 0.305: 64.44,52.55 SV2.31 64.45,52.55 65.08,51.91 65.08,37.62 65.72,36.99 65.72,34.92 64.61,33.81 64.59,33.82 SV1.31
  Bottom 0.254: SV1.31 64.26,33.81 63.21,34.86 63.21,37.48 arc45 63.14,37.66 60.8,40 33.38,40 arc45 33.2,39.93 30.14,36.88 30.14,28.3 31.77,26.67 31.75,26.65 v31.75,26.62
PA31  (via drill 0.6 pad 1.42)
  Top 0.254: U1.52 41.76,26 v38.26,29.5
  Top 0.305: SV2.32 64.44,54.61 63.18,53.34 63.18,52.39 64.45,51.12 64.45,36.51 64.59,36.36 | 64.59,36.36 64.61,36.35 | SV1.32 64.59,36.36
  Bottom 0.254: v38.26,29.5 36.31,29.5 32.22,25.4 30.95,25.4 29.45,26.9 29.45,31.36 29.43,31.38 29.42,31.37 | 29.42,31.37 27.77,33.02 27.77,33.04 27.62,33.2 arc-45 27.61,33.22 27.61,38.07 30.1,40.57 arc-45 30.28,40.64 61.43,40.64 64.39,37.68 arc-45 64.46,37.5 64.46,36.38 SV1.32 | 29.42,31.37 29.45,31.35 | SV1.32 64.43,36.34 | SV1.32
PLLRC
  Top 0.254: U1.63 47.23,17.73 47.23,17.11 48.11,16.23 49.13,16.23 50.03,15.32 R1.2 51.19,15.32 51.27,15.24 51.05,15.03 C2.1
TCK
  Top 0.254: U1.53 42.26,17.04 38.91,13.69 38.91,8.85 38,7.93 38,5.23 35.86,3.09 15.12,3.09 13.8,4.42 13.8,10.07 14.47,10.74 16.33,10.74 17.64,12.06 | 17.64,12.06 17.68,12.1 | 17.64,12.06 SV3.9
  Bottom 0.254: R10.2 17.63,15.26 JP7.3 SV3.9
  Bottom 0.406: 17.61,12.03 | 17.61,12.03 SV3.9 17.63,12.08 | 17.61,12.03 17.63,12.03
TDI  (via drill 0.6)
  Top 0.254: U1.33 39.31,27.2 40.48,26.04 40.48,19.1 39.13,17.76 39.13,17.28 36.55,14.7 36.56,14.7 | 36.56,14.7 36.57,14.71 | 36.56,14.7 36.42,14.55 36.42,13.09 36.03,12.7 32.22,12.7 31.58,13.33 13.81,13.33 SV3.5
  Bottom 0.254: SV3.5 11.75,12.06 10.54,13.28 10.54,17.95 11.53,18.93 R12.2
  Bottom 0.406: SV3.5 12.53,12.03 v12.59,12.03
TDO
  Top 0.254: U1.49 40.26,17.61 36.93,14.28 36.93,10.99 36.68,10.74 24.13,10.74 22.81,12.06 SV3.13
  Bottom 0.254: SV3.13 23.96,13.33 23.96,17.78 22.68,19.06 R9.2
TMS
  Top 0.254: 15.27,11.72 15.24,11.69 | 15.27,11.72 SV3.7 15.08,4.45 15.71,3.81 31.46,3.81 | 15.27,11.72 15.28,11.73 | U1.51 41.26,16.91 38.19,13.83 38.19,9.15 37.37,8.34 37.37,5.44 35.72,3.79 31.46,3.79 31.46,3.81 | 31.46,3.81 31.58,3.81
  Bottom 0.254: SV3.7 14.44,12.7 13.71,12.7 13.05,13.37 11.54,13.37 11.2,13.71 11.2,17.1 13.09,18.99 R11.2
TST
  Top 0.254: U1.40 39.22,23.7 39.46,23.46 39.46,19.57 38.92,19.03 38.5,19.03 37.9,18.43 37.9,17.57 36.84,16.51 35.39,16.51 34.12,15.88 JP12.1
USB_DP_PUP
  Bottom 0.406: Q2.2 87.78,23.81 JP9.2
VBUS
  Top 0.406: C21.1 69.42,9.57 69.35,9.57 69.35,11.43 69.35,12.06 X1.1 | 88.73,13.97 88.73,13.33 88.1,12.7 88.1,10.16 87.47,9.53 SV5.2
  Top 0.813: SV5.2 86.83,8.26 79.21,0.64 65.24,0.64 64.61,1.27 64.61,10.16 | 64.61,10.16 64.61,10.79 65.24,11.43 69.35,11.43 | R17.2 63.97,9.53 64.61,10.16 | SV4.2 SV4.1 SV6.2 SV6.1 77.3,29.21 88.73,17.78 88.73,13.97
  Bottom 0.406: Q2.1 83.97,21.91 83.66,22.23 R8.2 83.66,21.59 77.94,21.59 77.94,13.33 80.48,10.79 84.92,10.79 86.19,9.53 SV5.2
VBUS_DET
  Bottom 0.406: JP8.2 86.19,25.4 83.66,25.4 R7.2 R8.1
VCC_12V
  Top 0.813: U$3.1 U$3.2 92.55,17.78 82.39,27.94 SV6.5 SV6.6 SV4.5 SV4.6
VDD_1_8V  (via drill 0.6 pad 1.42)
  Top 0.254: U1.8 50.34,23.2 50.63,23.5 50.63,24.14 | 50.63,24.14 50.63,24.32 50.94,24.62 C5.1 54,24.64 | 54,24.64 54.01,24.65 | 54,24.64 C5.1 | 50.63,24.14 50.64,24.14 50.65,24.12 v51.19,24.02
  Top 0.406: C5.1 54,25.75
  Top 0.61: 54,25.75 54.01,25.76 60.07,25.76 60.08,25.77 64.34,25.77 64.61,26.04 64.61,27.95 64.47,28.08 | 64.47,28.08 64.46,28.1 | 64.47,28.08 JP5.1
  Top 0.813: 64.47,28.03 64.49,28.02 | JP5.1 64.47,28.03 | JP6.1 JP5.1 64.47,28.03
  Bottom 0.813: 51.19,24.05 51.27,24.13 | 51.19,24.05 v51.19,24.02 | C6.1 50.05,22.92 51.19,24.05
VDD_3_3V
  Top 0.61: SV5.3 84.29,13.33 83.02,14.61 83.02,19.69 80.11,22.6 C22.1
  Top 0.813: C22.1 80.2,22.56 80.17,22.53 80.13,22.57 77.43,22.57 76.45,21.59 JP4.1 JP2.1 JP1.1 JP3.1 74.77,31.54 72.48,33.82 SV1.37 SV1.38 | SV1.38 72.1,36.41 | 72.06,52.94 SV2.37 | SV1.38 72.06,52.93 72.06,52.94 | SV2.38 72.06,55.25 72.07,55.24 72.06,55.24 72.06,52.94
  Bottom 0.406: 92.82,23.22 92.55,23.5 | 92.82,23.22 R16.1 | 92.82,23.22 93.5,22.55 Q3.2 93.35,19.52 | SV5.3 84.92,12.06 86.19,10.79 87.47,10.79 88.1,11.43 88.1,12.7 91.28,15.88 93.18,15.88 93.81,16.51 93.81,19.05 93.35,19.52 | 93.35,19.52 93.18,19.69
  Bottom 0.61: 17.67,20.74 R10.1 22.64,20.78 22.66,20.76 R9.1 22.71,20.76 22.79,20.84 R14.1
  Bottom 0.813: 40,4.61 39.84,4.45 | 40,4.61 JP10.2 | JP4.1 74.77,19.79 arc-45 74.69,19.61 74.13,19.05 70.32,19.05 70.32,17.89 arc-45 70.25,17.71 62.06,9.53 56.45,9.53 arc45 56.28,9.45 55.71,8.89 55.71,7.37 arc-45 55.64,7.19 55.64,3.1 53.81,1.27 40.01,1.27 | 40.01,1.27 10,1.27 10,6.98 SV3.2 | SV3.2 | 40.01,1.27 40.01,1.23 40,1.24 40,4.61 | SV3.2 SV3.1 | SV3.1 | SV3.1 7.45,20.32 7.46,20.32 7.46,20.49 7.77,20.81 9.94,20.81 9.95,20.8 R13.1 R12.1 11.53,20.79 | 11.53,20.79 | 11.53,20.79 R12.1 13.08,20.81 R11.1 17.57,20.78 17.6,20.76 R10.1
VDDCORE  (via drill 0.6 pad 1.27, 0.6 pad 1.42)
  Top 0.254: U1.54 42.76,16.78 41.74,15.75 v41.74,13.97 | 40.07,13.08 40.05,13.11 C11.1 40.92,13.15 v41.74,13.97 | U1.24 44.26,30.29 v43.91,30.64 | v41.74,13.97 | U1.12 50.26,25.2 50.72,25.66 51.85,25.66 53.8,27.61 | 57.3,31.12 57.3,31.16 | 54.68,27.89 54.69,27.9 | v54.66,27.89 54.68,27.89 | 54.68,27.89 54.4,27.61
  Top 0.61: 54.4,27.61 53.8,27.61
  Top 0.813: 57.27,31.16 57.3,31.16 JP6.2 | v54.66,27.89 54.66,28.17 55.39,28.91 55.39,29.2 57.31,31.12 57.3,31.12
  Bottom 0.813: v43.91,30.64 43.91,26.82 C9.1 | C9.1 44.07,26.66 | v41.74,13.97 41.91,13.97 44.01,16.07 44.01,26.62 C9.1 | 44.07,26.66 44.07,26.62 | 44.07,26.66 C9.1 | 44.07,26.62 44.01,26.57 | 44.07,26.62 44.07,30.38 43.97,30.48 45.87,30.48 47.14,29.21 53.49,29.21 54.76,27.94 54.71,27.89 v54.66,27.89 54.66,26.01 C10.1
VDDFLASH  (via drill 0.6 pad 1.42)
  Top 0.254: U1.59 45.26,15.38 45.97,14.66 46.71,14.66 47.24,14.13 47.73,14.13 47.98,13.88 | 47.98,13.88 47.98,13.29 47.76,13.07 47.37,13.07 46.3,12 | 46.3,12 46.24,11.95 | C16.1 46.3,12 | 47.98,13.88 47.51,13.88 v47.26,13.63
  Bottom 0.813: v47.26,13.63 51.6,13.63 54.45,10.79 61.32,10.79 arc45 61.5,10.87 68.41,17.78 68.41,20.85 arc-45 68.49,21.03 69.05,21.59 JP4.2
VDDIN  (via drill 0.6, 0.6 pad 1.42)
  Top 0.254: C8.1 53.63,22.7 52.66,22.7 | 52.66,22.7 U1.7 | v52.76,23.39 52.67,22.71 52.66,22.7
  Top 0.406: C8.1 53.06,23.08 v52.77,23.27
  Bottom 0.813: JP1.2 arc-45 72.21,27.94 69.36,27.94 64.86,23.44 arc45 64.79,23.26 64.79,17.62 60.58,13.41 arc-45 60.41,13.33 55.71,13.33 52.75,16.3 52.75,20.95 C7.1 | C7.1 | C7.1 52.91,23.23 v52.76,23.38 v52.76,23.39
VDDIO  (via drill 0.6 pad 1.27, 0.6 pad 1.42)
  Top 0.254: 44.79,17.77 U1.58 44.76,14.2 v45.3,13.65 v45.31,13.66 45.31,11.13 45.81,10.63 C15.1 | U1.45 36.23,21.2 C13.1 | C14.1 47.25,30.3 U1.18 47.26,31.3 v47.72,31.76
  Top 0.813: 35.73,20.72 35.74,20.73 | 35.73,20.72 C13.1 | v34.42,20.62 35.64,20.62 35.73,20.72
  Bottom 0.254: v45.31,13.66 45.34,13.94 45.38,13.97
  Bottom 0.813: v47.72,31.76 47.54,31.76 47.36,31.94 47.36,32.05 47.45,32.13 43.18,32.13 42.31,31.27 42.31,21.85 42.01,21.55 | 42.01,21.55 41.76,21.3 35.09,21.3 v34.42,20.62 | 42.01,21.55 42.38,21.18 42.38,16.51 40.48,14.61 40.48,13.33 41.11,12.7 42.38,12.7 43.6,13.92 | 43.6,13.92 43.62,13.95 | 43.6,13.92 43.57,13.96 43.59,13.97 44.92,13.97 | 44.92,13.97 45.38,13.97 45.41,13.97 | 44.92,13.97 46.19,15.24 51.91,15.24 55.08,12.06 60.69,12.06 arc45 60.87,12.14 66.51,17.78 66.51,22.76 arc-45 66.58,22.93 68.41,24.77 JP2.2 | v34.42,20.62 34.46,20.62 34.47,20.64 34.46,20.65 | v34.42,20.62 34.61,20.62 34.77,20.79 36.33,19.23 36.33,13.35 34.41,11.43 JP12.2 JP13.1
VDDPLL  (via drill 0.6 pad 1.42)
  Top 0.254: U1.64 47.77,17.31 48.17,16.91 C17.1 55.43,16.91 56.09,16.25 56.72,16.25 v56.76,16
  Bottom 0.254: v56.76,16 57.72,15.94 57.96,15.96 59.2,15.96 59.29,16.03 59.98,16.73 60.02,26.15 JP5.2

### Text on the board
Dimension: 79.37 | 64.37 | 39.37 | PA7 | PA8 | PA9 | PA10 | PA11 | PA12 | PA26 | PA25 | PA24 | PA13 | PA14 | PA15 | PA16 | PA6 | TDI | PA23 | PA20 | PA4 | PA5 | PA19 | PA22 | PA28 | PA27 | PA21 | NRST | TST | PA17 | PA18 | PA29 | PA30 | PA2 | PA3 | AD6 | AD7 | GND | VDDIO | AD5 | AD4 | PA1 | PA0 | TDO | JTAGSEL | TMS | PA31 | TCK | ERASE | DDM | DDP | XOUT | XIN | 14.37 | -0.63 | -0.47
tDocu: VDDIO | GND | VDDCORE | VDDCORE | VDDOUT | VDDIN | GND | GND | ADVREF | VDDIO | VDDFLASH | PLLRC | VDDCORE | VDDPLL